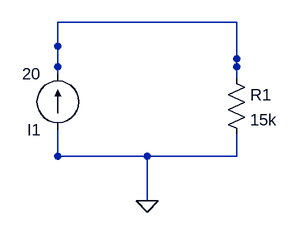
[diagram p0: schematic pannel3.asc]
pannel3.asc, the LTspice schematic file:
Version 4
SHEET 1 880 680
WIRE 640 400 640 372
WIRE 640 512 640 480
SYMBOL res 624 384 R0
SYMATTR InstName R1
SYMATTR Value 15k
WIRE 384 474 384 514
WIRE 384 354 384 394
SYMBOL current 384 474 R180
SYMATTR InstName I1
SYMATTR Value 20
FLAG 512 576 0
WIRE 384 320 448 320
WIRE 384 320 384 384
WIRE 640 320 640 384
WIRE 576 320 640 320
WIRE 576 512 640 512
WIRE 512 512 576 512
WIRE 512 512 512 576
WIRE 448 512 512 512
WIRE 384 512 448 512
WIRE 448 320 512 320
WIRE 512 320 576 320

The netlist it stands for:
* pannel3.asc
R1 N001 0 15k
I1 0 N001 20
.backanno
.end